# Altium schematic sheet [7] PowerManagement.SchDoc
size A3; DocumentNumber: 7; SheetNumber: 7; SheetTotal: 9
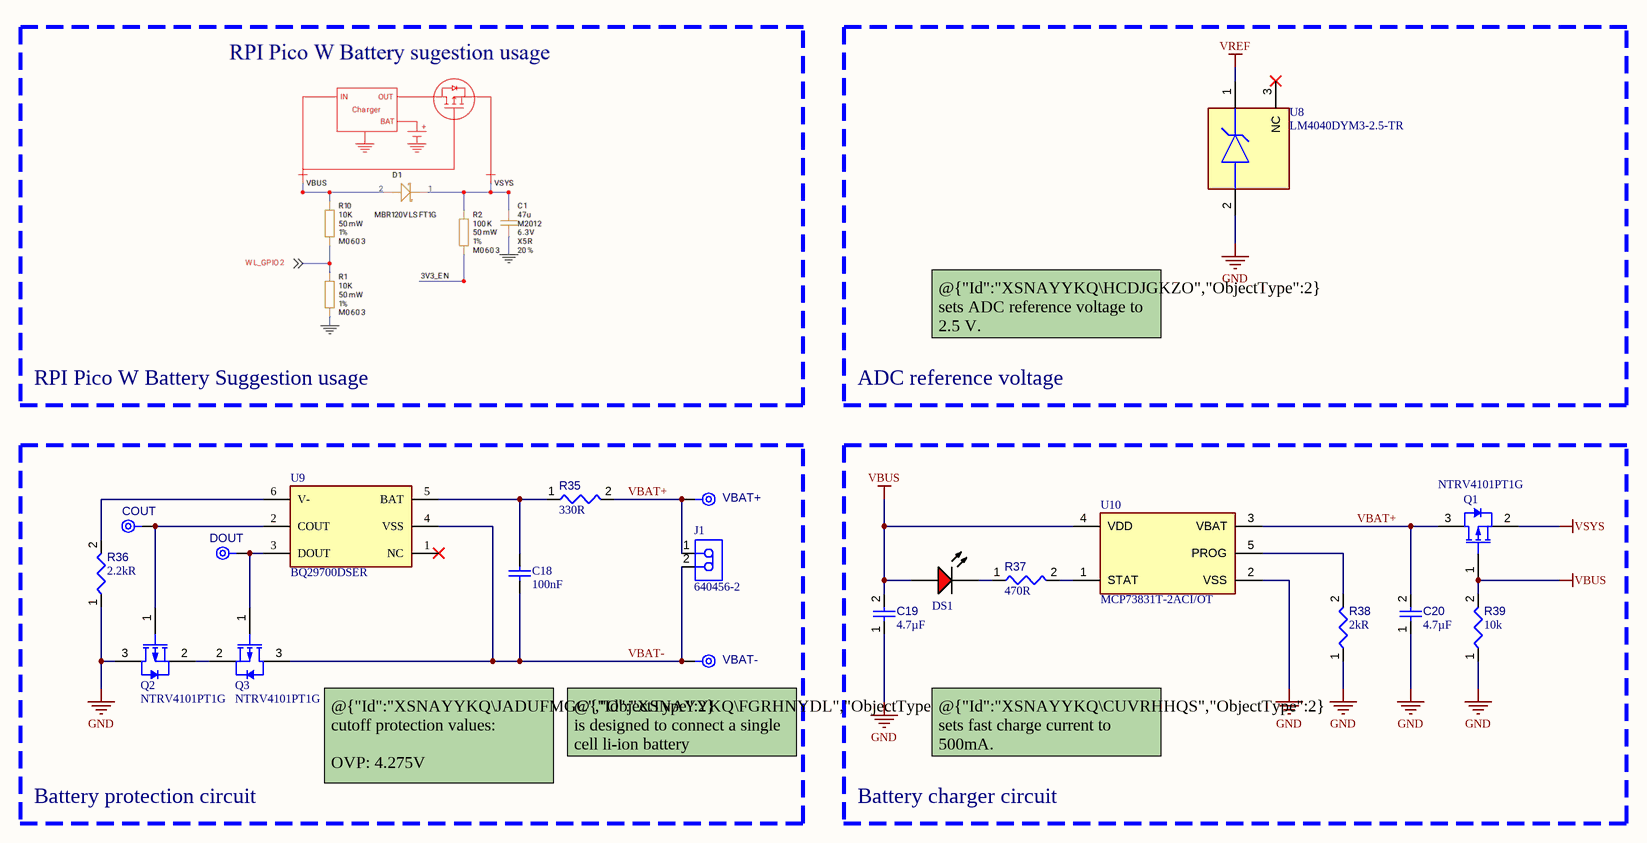
[diagram p0: [7] PowerManagement.SchDoc]

## Parts
C18  value 100nF  [CAPC0603(1608)100_L]  (hidden comment: VJ0603Y104MXJCW1BC)
C19  value 4.7µF  [CAPC0603(1608)100_L]  (hidden comment: Capacitor 4.7µF +/-20% 10V 0603)
C20  value 4.7µF  [CAPC0603(1608)100_L]  (hidden comment: Capacitor 4.7µF +/-20% 10V 0603)
COUT  TPAD6R  [TP06R]  (value not drawn)  (no BOM)
DOUT  TPAD6R  [TP06R]  (value not drawn)  (no BOM)
DS1  19-217/R6C-AL1M2VY/3T  [EVRL-0603-2_V]  (value not drawn)
J1  640456-2  [TECO-640456-2_V]
Q1  NTRV4101PT1G  [ONSC-SOT-23-3-318-08_V]
Q2  NTRV4101PT1G  [ONSC-SOT-23-3-318-08_V]
Q3  NTRV4101PT1G  [ONSC-SOT-23-3-318-08_V]
R35  value 330R  [RESC0603(1608)_L]  (hidden comment: ERJ-3EKF3300V)
R36  value 2.2kR  [RESC0603(1608)_L]  (hidden comment: CRCW06032K20FKEA)
R37  value 470R  [RESC0603(1608)_L]  (hidden comment: CRCW0603470RJNEA)
R38  value 2kR  [RESC0603(1608)_L]  (hidden comment: ERJ-3EKF2001V)
R39  value 10k  [RESC0603(1608)_L]  (hidden comment: Resistor 10k +/-1% 0603 100 mW)
U8  LM4040DYM3-2.5-TR  [FP-SOT23-3LD-PL-1-IPC_A]
U9  BQ29700DSER  [FP-DSE0006A-MFG]
U10  MCP73831T-2ACI/OT  [FP-C04-091-OT-MFG]
VBAT+  TPAD6R  [TP06R]  (value not drawn)  (no BOM)
VBAT-  TPAD6R  [TP06R]  (value not drawn)  (no BOM)

## Blocks framed on the sheet
ADC reference voltage: U8
Battery protection circuit: C18 COUT DOUT J1 Q2 Q3 R35 R36 U9 VBAT+ VBAT-
Battery charger circuit: C19 C20 DS1 Q1 R37-R39 U10

## Nets
GND: C19.1 C20.1 Q2.3(D) R36.1 R38.1 R39.1 U8.2(-) U10.2(VSS)
VBUS: C19.2 DS1.1(A) Q1.1(G) R39.2 U10.4(VDD)
VREF: U8.1(+)
VSYS: Q1.2(S)
VBAT+: C20.2 J1.1 Q1.3(D) R35.2 U10.3(VBAT) VBAT+.1(TP)
VBAT-: C18.1 J1.2 Q3.3(D) U9.4(VSS) VBAT-.1(TP)
NetC18_2: C18.2 R35.1 U9.5(BAT)
NetCOUT_1: COUT.1(TP) Q2.1(G) U9.2(COUT)
NetDOUT_1: DOUT.1(TP) Q3.1(G) U9.3(DOUT)
NetDS1_2: DS1.2(K) R37.1
NetQ2_2: Q2.2(S) Q3.2(S)
NetR36_2: R36.2 U9.6(V-)
NetR37_2: R37.2 U10.1(STAT)
NetR38_2: R38.2 U10.5(PROG)

Not connected (* = marked no-connect by the designer): U8 3(NC)*; U9 1(NC)*

## Notes on the sheet
- @{"Id":"XSNAYYKQ\HCDJGKZO","ObjectType":2} sets ADC reference voltage to 2.5 V.
- RPI Pico W Battery Suggestion usage
- (near VBAT-) @{"Id":"XSNAYYKQ\FGRHNYDL","ObjectType":2} is designed to connect a single cell li-ion battery
- @{"Id":"XSNAYYKQ\CUVRHHQS","ObjectType":2} sets fast charge current to 500mA.
- @{"Id":"XSNAYYKQ\JADUFMGC","ObjectType":2} cutoff protection values:
  OVP: 4.275V
  UVP: 2.8V
- REVISION
- DESCRIPTION
- DATE
- APPROVED
- ADDRESS
- PROJECT
- VERSION
- TITLE
- A3
- SIZE
- SCALE
- DOCUMENT NAME:
- DOCUMENT REVISION:
- OF
- SHEET:
- PROJECT REVISION:

## Library data of the parts
C18 = CMP-001-00085-1: Multilayer Ceramic Capacitor, 0.1 uF, 16 V, ± 20%, X7R, 0603 [1608 Metric]; Dielectric Material: Tantalum; Voltage Rating: 16V; Packaging: Tape and Reel; Min Operating Temperature: -55°C; Case/Package: 0603; Length: 1.6mm; Termination: SMD/SMT; Height: 0.95mm; Mounting Technology: Surface Mount; Width: 0.8mm; Case Code (Imperial): 0603; Construction: Flat; Lead Free: Lead Free; Package Quantity: 4000; Max Operating Temperature: 125°C; Dielectric: X7R; RoHS Compliant: Yes; Depth: 0.8mm; Tolerance: 20%; Series: VJ; Case Code (Metric): 1608; Voltage Rating (DC): 16V
C19 C20 = CMP-001-00076-4: Chip Capacitor, 4.7µF +/-20%, 10V, 0603, Thickness 1 mm; Tolerance: 10%; Mounting Technology: SMT; Case/Package: 0603; Pins: 2; Min Operating Temperature: -55°C; Max Operating Temperature: 85°C; Voltage Rating: 10V
COUT DOUT VBAT+ VBAT- = CMP-00028-00002-2: 0.6mm round; Pins: 1; Component Type: Mechanical
DS1 = CMP-007-00004-2: Chip LED, Red, 5 V, 25 mA, -40 to 85 degC, 2-Pin SMD (0603), RoHS, Tape and Reel; Manufacturer: Everlight Electronics; Forward Voltage: 2.2V; Lens Style: Clear; Package Reference: 0603; Datasheet Version: Rev. 1, 01/2005; Mounting Technology: SM; RoHS Compliant: False; Datasheet URL: https://datasheet.ciiva.com/4688/el-19-217-r6c-al1m2vy-3tpdf-187026-4688713.pdf; Case/Package: 0603; Colour: Red; Manufacturer URL: http://www.everlight.com/; Package Description: 2-Pin Surface Mount Device, Body 1.6 x 0.8 mm
J1 = CMP-002-00073-1: Connector 250V AC/DC 5A 2P 1 Row PCB - Vertical Mounting Polyester White; Contact Retention: No (Without); PCB Thickness: 0.063inch; Approvals: CSA; Contact Post Length: 3.56mm; Gender: Male; Circuit Application: Signal; Tail Length: 0.14inch; Plating Thickness: 3.81um; Plating: Tin; Mating Connector Lock: Yes (With); PCB Mount Retention: Without; Contact Style: Straight; Number of Positions: 2; Connector System: Wire-to-Board; Pitch: 2.54mm; Connector Type: Connector,Pin,Plug,Header; Voltage Rating: 250V; Termination: Solder; Contact Current Rating: 5A; PCB Mount Alignment: No (Without); Housing Material: Polyester; Contact Material: Copper Alloy; Current Rating: 5A; Mounting Ears: No (Without); Strain Relief: No (Without); Shrouded: No (Without); Min Operating Temperature: -67°C; Orientation: Straight; Series: MTA-100; Panel Mount Retention: No (Without); Package Quantity: 5000; Height: 7.87mm; Length: 7.62mm; PCB Mounting Orientation: Vertical; Flammability Rating: UL94 V-0; Operating Supply Voltage: 250V; Contact Plating: Tin; Mounting Technology: Through Hole; Voltage Rating (AC): 250V; Backwall/Post Interruptions: No (Without); Contact Mating Length: 7.49mm; Color: Beige; Voltage Rating (DC): 250V; Lead Free: Lead Free; Reach SVHC Compliant: Unknown; Sealable: No (Without); Mating Alignment: No (Without); Mating Retention: No (Without); Number of Contacts: 2; Contact Shape: Square; Max Operating Temperature: 221°C; Number of Rows: 1; RoHS Compliant: Yes; Housing Color: Natural
Q1-Q3 = CMP-013-00034-1: NTRV4101PT1G P-channel MOSFET Transistor; 1.7 A; 20 V; 3-Pin SOT-23; Gate to Source Voltage (Vgs): 8V; Continuous Drain Current (ID): 3.2A; Input Capacitance: 675pF; Turn-On Delay Time: 7.5ns; Rds On Max: 85mR; Power Dissipation: 1.25W; Rise Time: 12.6ns; Max Power Dissipation: 420mW; Drain to Source Resistance: 70mR; Element Configuration: Single; Turn-Off Delay Time: 30.2ns; Fall Time: 21ns; Drain to Source Voltage (Vdss): 20V; Number of Elements: 1; Case/Package: SOT-23-3; RoHS Compliant: Yes; Polarity: P-CHANNEL; Height: 1.01mm; Packaging: Tape and Reel; Series: -; Package Quantity: 3000; Max Operating Temperature: 150°C; Length: 3.04mm; Lead Free: Lead Free; Pins: 3; Radiation Hardening: No; Width: 1.4mm; Min Operating Temperature: -55°C
R35 = CMP-009-00184-1: SMD Chip Resistor, 330 Ohm, ± 1%, 100 mW, 0603 [1608 Metric], Thick Film, Precision; Current Rating: 500mA; Voltage Rating (DC): 75V; Power Rating: 100mW; Gender: Male; Temperature Coefficient: 100ppm/°C; Termination: SMD/SMT; Construction: Rectangular; Contact Plating: Tin; Resistor Type: Thick Film; Features: Automotive AEC-Q200; Max Operating Temperature: 155°C; Weight: 7.1E-05oz; Package Quantity: 5000; Lead Pitch: 1.1mm; Radiation Hardening: No; Lead Free: Lead Free; Min Operating Temperature: -55°C; Reach SVHC Compliant: No; Pins: 2; Number of Terminations: 2; Width: 0.8mm; RoHS Compliant: Yes; Depth: 0.8mm; Packaging: Tape and Reel; Voltage Rating: 75V; Mounting Technology: Surface Mount; Case Code (Metric): 1608; Resistance Tolerance: 1%; Tolerance: 1%; Case Code (Imperial): 0603; Length: 1.6mm; Height: 0.45mm; Military Standard: Not; Series: ERJ; Max Power Dissipation: 100mW; Case/Package: 0603; Contact Material: Copper
R36 = CMP-009-00186-1: SMD Chip Resistor, 2.2 kOhm, ± 1%, 100 mW, 0603 [1608 Metric], Thick Film, General Purpose; Voltage Rating (DC): 75V; Max Power Dissipation: 100mW; Temperature Coefficient: 100ppm/°C; Depth: 0.85mm; Height: 0.45mm; Contact Plating: Tin; Resistance Tolerance: 1%; Ratings: AEC-Q200; Weight: 7.1E-05oz; Series: CRCW; Case Code (Imperial): 0603; Construction: Rectangular; Width: 0.033inch; Reach SVHC Compliant: Unknown; Case Code (Metric): 1608; Resistor Type: Thick Film; Packaging: Tape and Reel; Case/Package: 0603; Package Quantity: 10; RoHS Compliant: Yes; Lead Free: Lead Free; Military Standard: Not; Termination: SMD/SMT; Tolerance: 1%; Technology: THICK FILM; Max Operating Temperature: 155°C; Voltage Rating: 75V; Power Rating: 100mW; Length: 1.55mm; Number of Terminations: 2; Radiation Hardening: No; Min Operating Temperature: -55°C; Features: Automotive AEC-Q200
R37 = CMP-009-00182-1: Res Thick Film 0603 470 Ohm 5% 0.1W(1/10W) ±200ppm/°C Pad SMD Automotive T/R; Max Power Dissipation: 100mW; Working Voltage: 75V; Case Code (Metric): 1608; Case Code (Imperial): 0603; Width: 0.85mm; Series: CRCW; Max Operating Temperature: 155°C; Features: Automotive AEC-Q200; Height: 0.45mm; Technology: THICK FILM; Power Rating: 100mW; Depth: 0.85mm; Min Operating Temperature: -55°C; Weight: 7.1E-05oz; RoHS Compliant: Yes; Number of Terminations: 2; Voltage Rating: 75V; Ratings: AEC-Q200; Case/Package: 0603; Contact Plating: Tin; Radiation Hardening: No; Termination: SMD/SMT; Tolerance: 5%; Construction: Rectangular; Package Quantity: 5000; Reach SVHC Compliant: Unknown; Length: 1.55mm; Resistor Type: Thick Film; Lead Free: Lead Free; Temperature Coefficient: 200ppm/°C; Resistance Tolerance: 5%; Packaging: Tape and Reel; Military Standard: Not
R38 = CMP-009-00181-1: SMD Chip Resistor, 2 kOhm, ï¿½ 1%, 100 mW, 0603 [1608 Metric], Thick Film, Precision; Power Rating: 100mW; Temperature Coefficient: 100ppm/°C; Voltage Rating: 75V; Voltage Rating (DC): 50V; Construction: Rectangular; Tolerance: 1%; Case Code (Imperial): 0603; Contact Plating: Tin; Packaging: Tape and Reel; Width: 0.8mm; Length: 1.6mm; Lead Free: Lead Free; Max Operating Temperature: 155°C; Number of Terminations: 2; Features: Automotive AEC-Q200; Min Operating Temperature: -55°C; Termination: SMD/SMT; Case/Package: 0603; Max Power Dissipation: 100mW; Reach SVHC Compliant: No; Radiation Hardening: No; RoHS Compliant: Yes; Resistance Tolerance: 1%; Pins: 2; Series: ERJ; Case Code (Metric): 1608; Mounting Technology: Surface Mount; Height: 0.022inch; Military Standard: Not; Depth: 0.8mm; Package Quantity: 1; Resistor Type: Thick Film
R39 = CMP-009-00017-7: Chip Resistor, 10 KOhm, +/- 1%, 01 W, -55 to 155 degC, 0603 (1608 Metric); Power: 100mW; Voltage Rating: 50V; Mounting Technology: SM; Max Operating Temperature: 155°C; Case/Package: 0603; Tolerance: 1%; RoHS Compliant: True; Pins: 2; Min Operating Temperature: -55°C
U8 = CMP-004-00033-1: LM4040 Series 2.5 V ±1 % Precision Micropower Shunt Voltage Reference - SOT-23; Max Output Voltage: 2.5V; Output Type: Fixed; Output Voltage: 10V; Cathode Current: 70uA; Temperature Coefficient: 150ppm/°C; Output Current: 15mA; Tolerance: 1%; Supply Current: 500nA; Max Operating Temperature: 85°C; Series: -; Min Output Voltage: 2.5V; Length: 2.92mm; Current Rating: 15mA; Pins: 3; Height: 1.01mm; Package Quantity: 3000; Max Output current: 15mA; Min Operating Temperature: -40°C; Packaging: Tape and Reel; Width: 1.3mm; Radiation Hardening: No; Case/Package: SOT-23; Reach SVHC Compliant: No; Reference Voltage: 2.5V; Lead Free: Lead Free; RoHS Compliant: Yes; Reference Type: Shunt; Mounting Technology: Surface Mount
U9 = CMP-001-0002-1: Li-Ion/Li Polymer Advanced Single-Cell Battery Protector IC Family 6-WSON -40 to 85; Fault Protection: Over Current,Short Circuit,Over/Under Voltage; Operating Supply Voltage: 8V; Number of Cells: 1; Case/Package: WFDFN; Lead Free: Lead Free; Pins: 6; Height: 800um; Packaging: Tape and Reel; Max Operating Temperature: 85°C; Weight: 0.000342oz; Mounting Technology: Surface Mount; Series: -; Contact Plating: Gold; Thickness: 750um; RoHS Compliant: Yes; Package Quantity: 3000; Width: 1.5mm; Length: 1.5mm; Min Operating Temperature: -40°C
U10 = CMP-001-0001-1: MCP73831 Series Single-Cell Li-Ion/Li-Polymer Battery Charge Controller SOT-23-5; Output Voltage: 4.2V; Number of Channels: 1; Fault Protection: Over Voltage; Min Supply Voltage: 3.75V; Max Supply Voltage: 6V; Max Power Dissipation: 1.54W; Output Current: 500mA; Voltage Rating: 4.534V; Drain to Source Resistance: 350mR; Min Output Voltage: 4.168V; Max Output Voltage: 4.5V; Mounting Technology: Surface Mount; Number of Outputs: 1; RoHS Compliant: Yes; Weight: 0.00709oz; Length: 3.1mm; Max Operating Temperature: 85°C; Series: -; Case/Package: SOT-23; Radiation Hardening: No; Pins: 5; Packaging: Tape and Reel; Lead Free: Lead Free; Number of Cells: 1; Width: 1.8mm; Height: 1.3mm; Max Charge Current: 500mA; Battery Pack Voltage: 4.2V; Reach SVHC Compliant: No; Termination: SMD/SMT; Min Operating Temperature: -40°C